# EAGLE board PCB_GW_ESP32_DIO_RS485 (EAGLE 7.7.0)
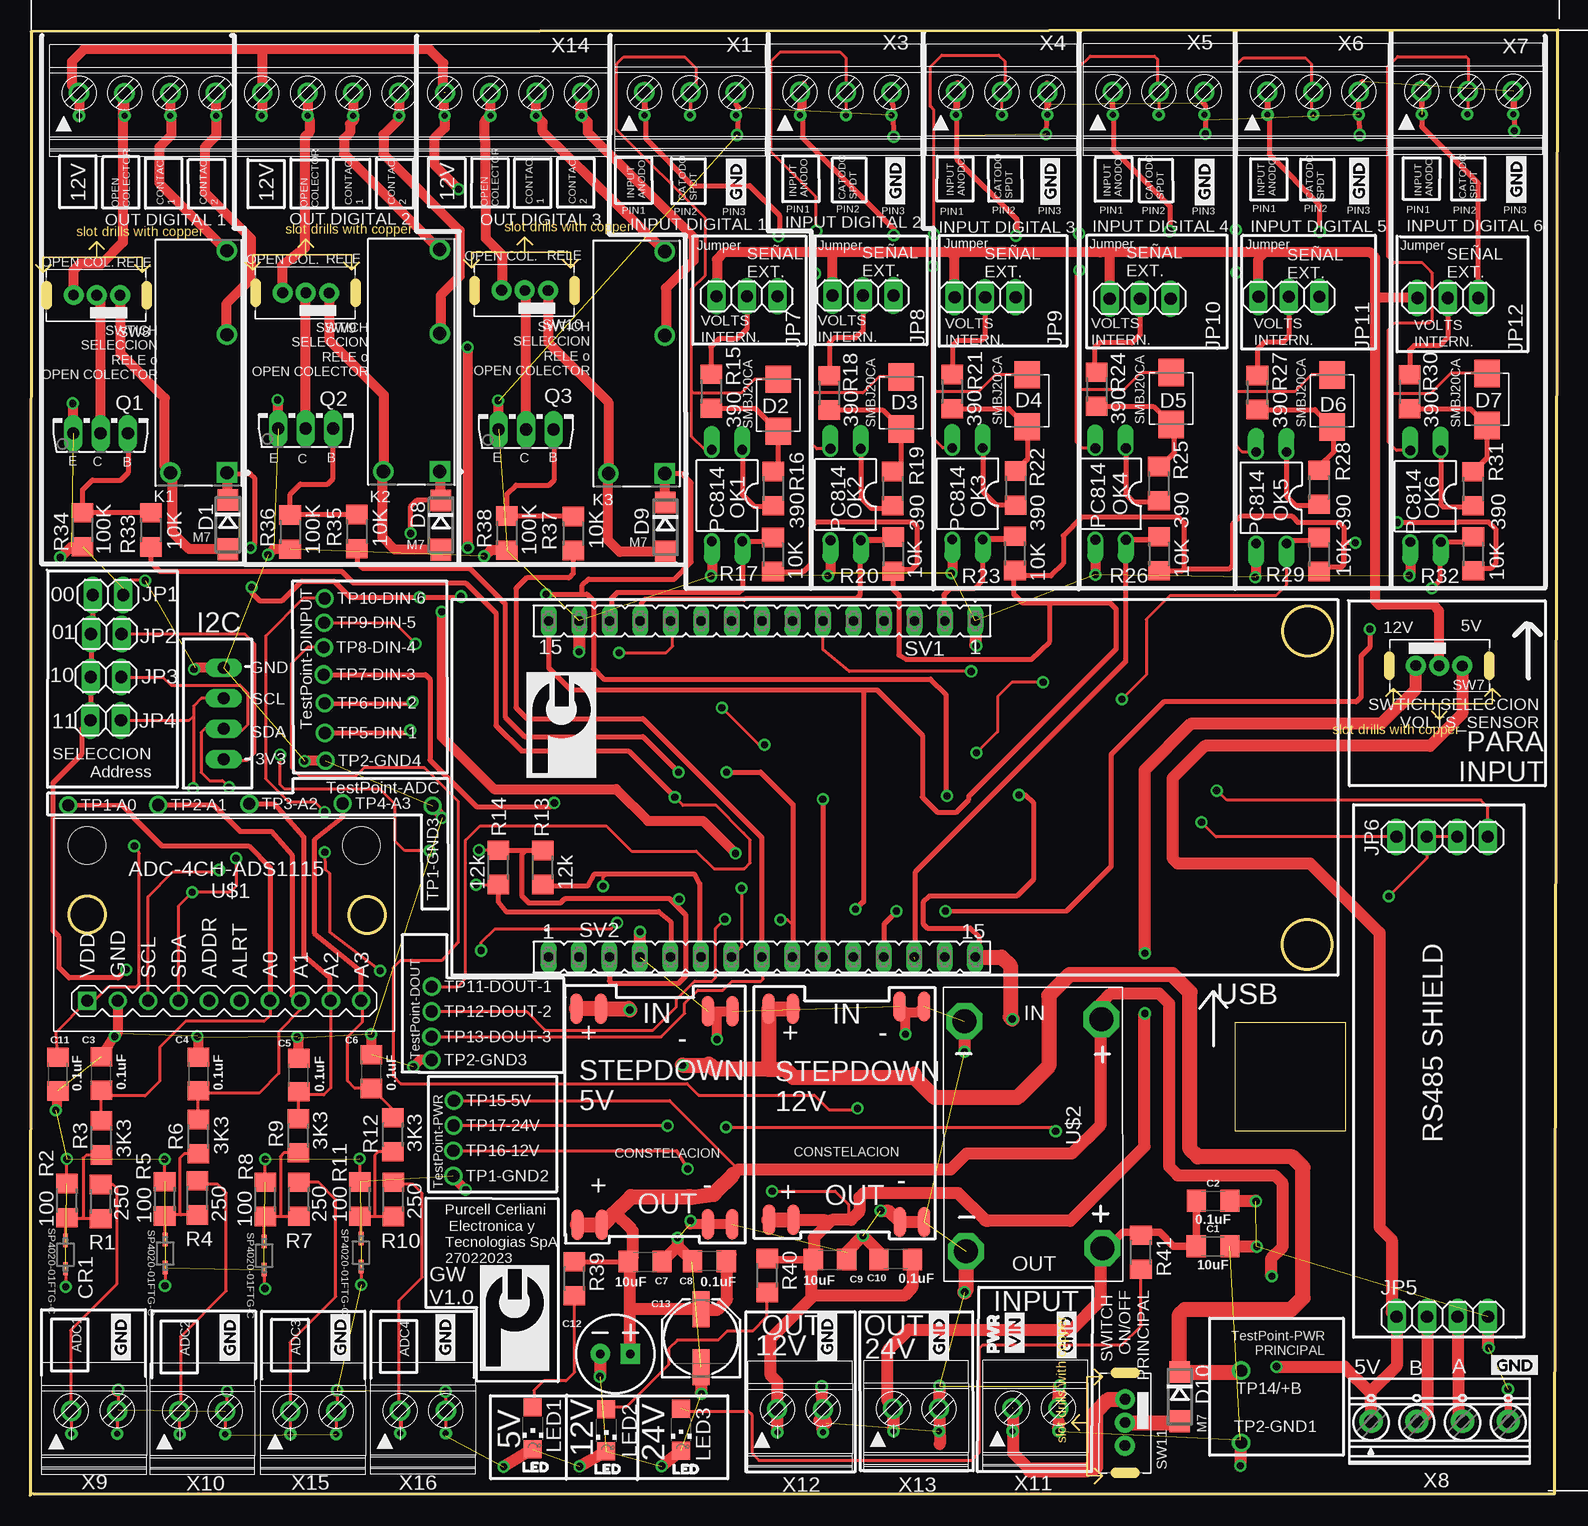
[diagram p2: board, top side]
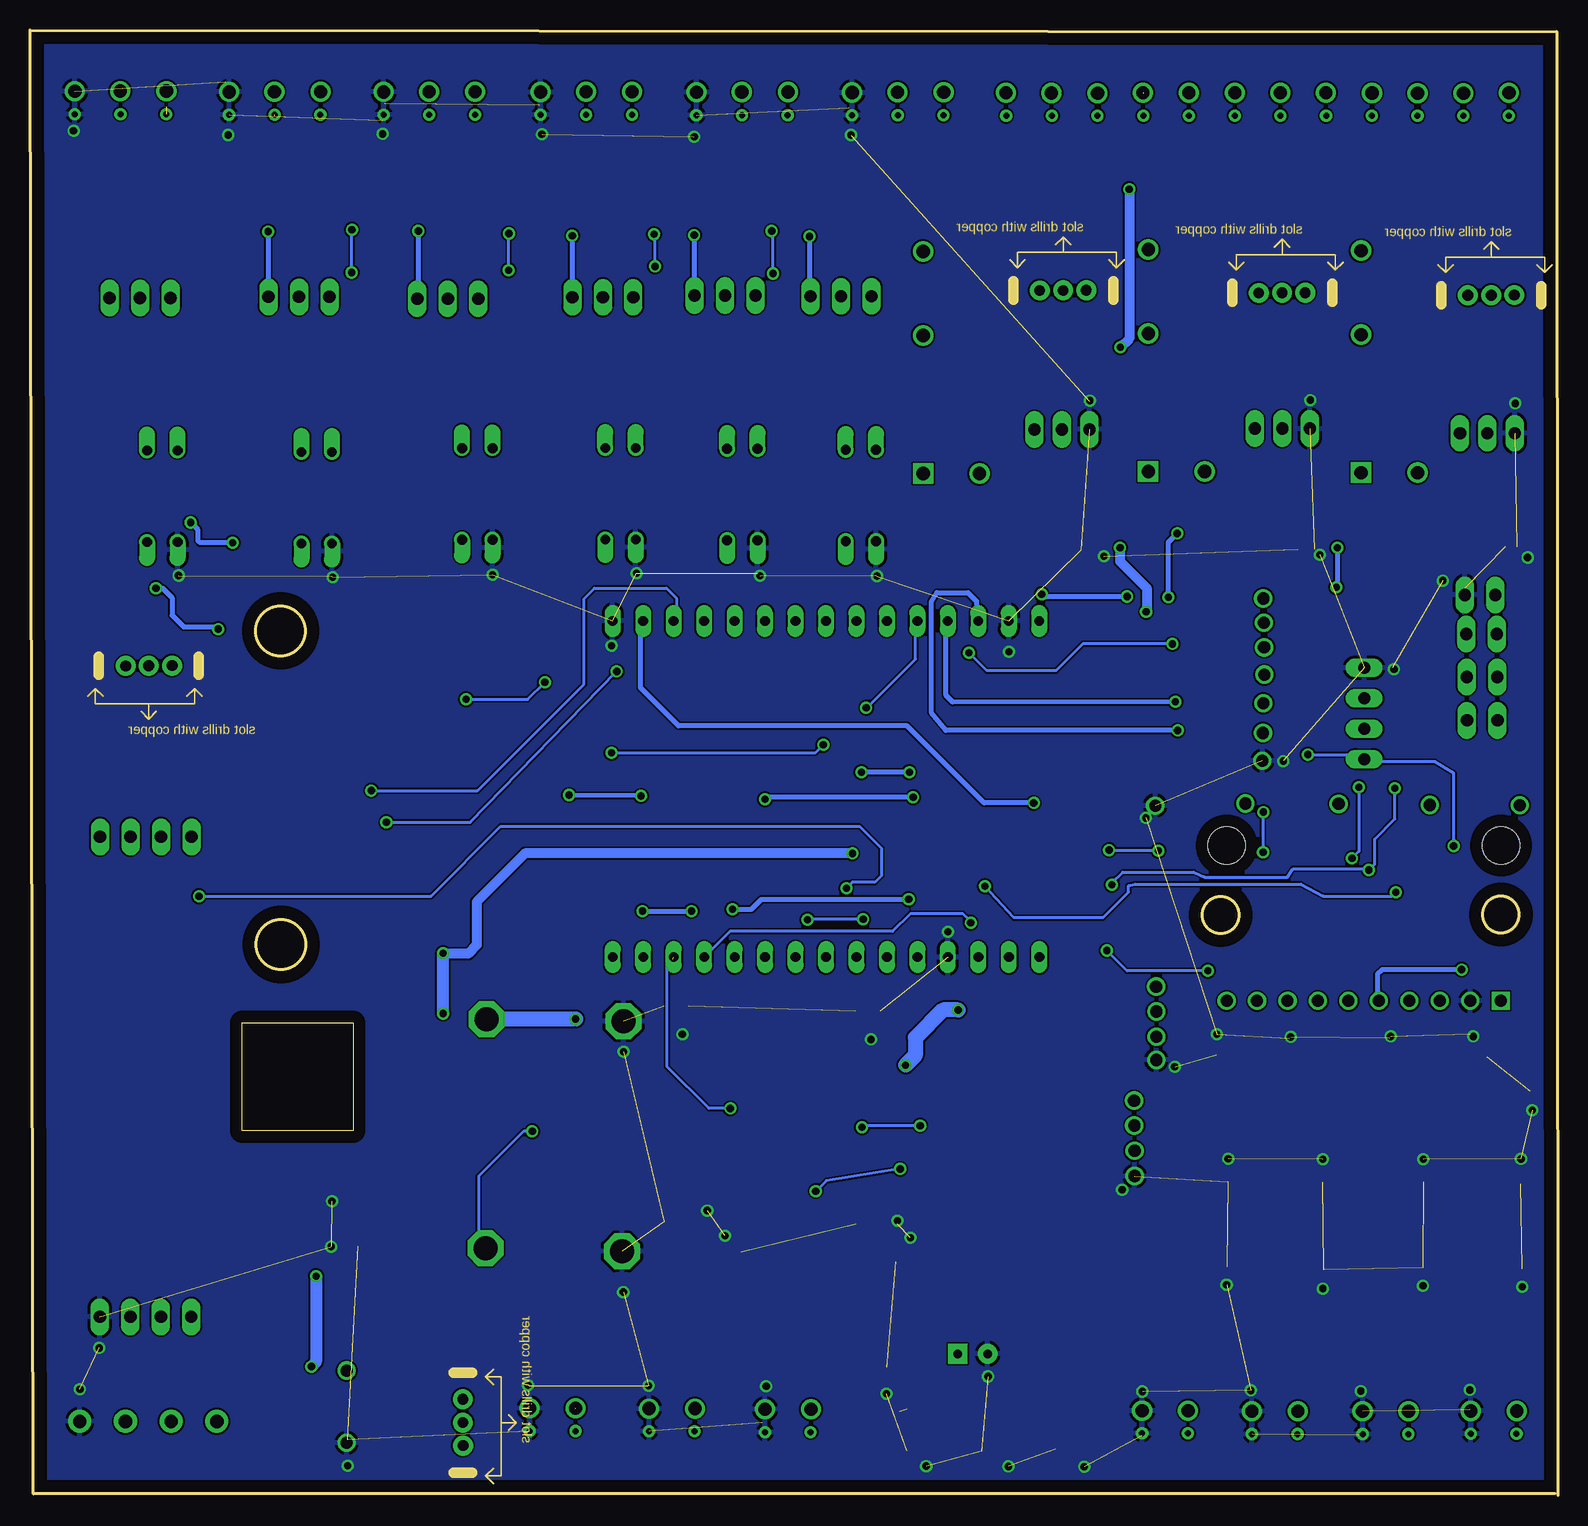
[diagram p3: board, bottom side, seen from below]

Size 127.37 x 122.13 mm. Coordinates in mm from the lower left corner, seen from the top.
Outline: 0.25,0.16 127.09,0.14 127.37,122.13 0.1,121.99 0,0
Outline: circle at 106.45,45.92 radius 2.07
Outline: circle at 106.49,72.05 radius 2.07
Outline: circle at 28.12,48.38 radius 1.5
Outline: circle at 4.76,48.42 radius 1.5
Copper layers (1*16): Top 0.035mm / dielectric 1.5mm / Bottom 0.035mm
Design rules "default": minimum track width 6mil, minimum drill 0.35mm, track to track 6mil, track to pad 6mil, pad to pad 6mil, via to via 6mil, smd to smd 6mil, copper to edge 40mil, drill to drill 6mil, minimum pad ring 10mil, minimum via ring 8mil, stop-mask expansion 4mil, vias tented up to drill 0mil, thermal gap 10mil

## Footprints (pad centres in the part's own frame; a part is rotated, then mirrored left to right if it is on the bottom)
1206 = smd 1.6 x 1.8: 1 -1.4,0; 2 1.4,0
CPOL-RADIAL-2.5MM-6.5MM = drill 0.7 pad 1.651 square: 1 1.25,0 | drill 0.7 pad 1.651: 2 -1.25,0
PANASONIC_D = smd 3 x 1.4: + 2.4,0; - -2.4,0
SOD323_LTF = smd 1.118 x 0.406: 1 -1.168,0; 2 1.168,0
DO214AC = smd 1.8 x 1.7: A 2.05,0; C -2.05,0
DIOM4336X265N = smd 2.28 x 2.12: 1 -2.165,0; 2 2.165,0
JST-XH-04-PACKAGE-LONG-PAD = drill 1.016 long: 1 -3.81,0; 2 -1.27,0; 3 1.27,0; 4 3.81,0
SOLDER_PAD_2 = smd 1.016 x 2.54: P$1 -1.016,0; P$2 1.016,0
1X02 = drill 1.016 long: 1 -1.27,0; 2 1.27,0
1X04 = drill 1.016 long: 1 -3.81,0; 2 -1.27,0; 3 1.27,0; 4 3.81,0
1X03 = drill 1.016 long: 1 -2.54,0; 2 0,0; 3 2.54,0
OMRON_G5NB-1A-E-DC5_0 = drill 1.1 pad 1.7 square: 1 -9.15,-2.35 | drill 1.1 pad 1.7: 2 2.35,-2.35; 3 9.35,-2.35; 4 -9.15,2.35
CHIPLED_1206 = smd 1.5 x 1.5: A 0,-1.75; C 0,1.75
DIL04 = drill 0.813 offset: 1 -1.27,-3.81; 2 1.27,-3.81; 3 1.27,3.81; 4 -1.27,3.81
TO126AV = drill 1.016 long: B 2.286,-1.27; C 0,-1.27; E -2.286,-1.27
R1206 = smd 1.6 x 1.803: 1 -1.422,0; 2 1.422,0
FE15 = drill 0.813 long: 1 -17.78,0; 2 -15.24,0; 3 -12.7,0; 4 -10.16,0; 5 -7.62,0; 6 -5.08,0; 7 -2.54,0; 8 0,0; 9 2.54,0; 10 5.08,0; 11 7.62,0; 12 10.16,0; 13 12.7,0; 14 15.24,0; 15 17.78,0
SW5-2.0-8.8X4.4X4.7MM-90D = drill 0.889 pad 1.651: A 0.01,1.952; B -0.01,-1.922; COM 0,0
TESTPOINT = drill 1.016: 1 0,0
ADC-4CH-ADS1115 = drill 1 square: 1 -6.35,11.43 | drill 1: 2 -6.35,8.89; 3 -6.35,6.35; 4 -6.35,3.81; 5 -6.35,1.27; 6 -6.35,-1.27; 7 -6.35,-3.81; 8 -6.35,-6.35; 9 -6.35,-8.89; 10 -6.35,-11.43 | hole 3.1: 6.604,11.43; 6.604,-11.43
DC-DC-STEP-UP-SX1308 = drill 2 pad 2.8 octagon: IN+ -14.87,6.3; IN- -14.73,-5.09; OUT+ 4.18,6.41; OUT- 4.47,-4.98
1705605 = drill 0.5 pad 0.9: 1.1 -13.335,-1.25; 2.1 -9.525,-1.25; 3.1 -5.715,-1.25 | drill 1.1 pad 1.676: 1.2 -13.355,0.67; 2.2 -9.505,0.67; 3.2 -5.725,0.65
1727036 = drill 1.1 pad 1.93: 1 -5.715,0; 2 -1.905,0; 3 1.905,0; 4 5.715,0
1705566 = drill 0.5 pad 0.9: 1.1 -5.715,-1.25; 2.1 -1.905,-1.25 | drill 1.1 pad 1.676: 1.2 -5.735,0.65; 2.2 -1.905,0.65
1705647 = drill 0.5 pad 0.9: 1.1 -20.955,-1.25; 2.1 -17.145,-1.25; 3.1 -13.335,-1.25; 4.1 -9.525,-1.25; 5.1 -5.715,-1.25; 6.1 -1.905,-1.25; 7.1 1.905,-1.25; 8.1 5.715,-1.25; 9.1 9.525,-1.25; 10.1 13.335,-1.25; 11.1 17.145,-1.25; 12.1 20.955,-1.25 | drill 1.1 pad 1.676: 1.2 -20.955,0.66; 2.2 -17.165,0.64; 3.2 -13.335,0.63; 4.2 -9.545,0.65; 5.2 -5.695,0.66; 6.2 -1.905,0.68; 7.2 1.885,0.68; 8.2 5.715,0.66; 9.2 9.555,0.67; 10.2 13.335,0.63; 11.2 17.175,0.65; 12.2 20.975,0.68

## Placement (x,y rotation side)
C1  10uF  [1206]  98.61,20.78 0 top
C2  0.1uF  [1206]  98.62,24.57 0 top
C3  0.1uF  [1206]  5.95,35.17 90 top
C4  0.1uF  [1206]  14.05,35.13 90 top
C5  0.1uF  [1206]  22.41,35.04 90 top
C6  0.1uF  [1206]  28.47,35.33 90 top
C7  10uF  [1206]  51.28,19.49 0 top
C8  0.1uF  [1206]  56.64,19.53 180 top
C9  10uF  [1206]  66.69,19.66 0 top
C10  0.1uF  [1206]  72.16,19.68 180 top
C11  0.1uF  [1206]  2.33,35.12 90 top
C12  100uF  [CPOL-RADIAL-2.5MM-6.5MM]  48.79,11.81 0 top
C13  100uF  [PANASONIC_D]  55.93,13.11 90 top
CR1  SP4020-01FTG-C  [SOD323_LTF]  2.96,20.07 90 top
CR2  SP4020-01FTG-C  [SOD323_LTF]  11.27,20.17 90 top
CR3  SP4020-01FTG-C  [SOD323_LTF]  19.52,19.99 90 top
CR4  SP4020-01FTG-C  [SOD323_LTF]  27.6,20.25 90 top
D1  [DO214AC]  16.49,80.91 270 top
D2  SMBJ20CA  [DIOM4336X265N]  62.36,90.86 270 top
D3  SMBJ20CA  [DIOM4336X265N]  72.62,91.06 270 top
D4  SMBJ20CA  [DIOM4336X265N]  83.13,91.23 270 top
D5  SMBJ20CA  [DIOM4336X265N]  95.14,91.42 270 top
D6  SMBJ20CA  [DIOM4336X265N]  108.55,91.22 270 top
D7  SMBJ20CA  [DIOM4336X265N]  121.44,91.35 270 top
D8  [DO214AC]  34.24,80.87 270 top
D9  [DO214AC]  52.95,80.7 270 top
D10  [DO214AC]  95.83,8.24 270 top
I2C  JST-XH-04-PIN-LONG-PAD  [JST-XH-04-PACKAGE-LONG-PAD]  16.15,65.17 90 top
J1  SOLDER_PAD_2  [SOLDER_PAD_2]  46.57,40.57 0 top
J2  SOLDER_PAD_2  [SOLDER_PAD_2]  57.53,40.35 0 top
J3  SOLDER_PAD_2  [SOLDER_PAD_2]  46.65,22.57 0 top
J4  SOLDER_PAD_2  [SOLDER_PAD_2]  57.52,22.6 0 top
J5  SOLDER_PAD_2  [SOLDER_PAD_2]  62.58,40.56 180 top
J6  SOLDER_PAD_2  [SOLDER_PAD_2]  73.52,22.8 180 top
J7  SOLDER_PAD_2  [SOLDER_PAD_2]  62.62,22.98 0 top
J8  SOLDER_PAD_2  [SOLDER_PAD_2]  73.51,40.76 0 top
JP1  00  [1X02]  6.49,75.05 0 top
JP2  01  [1X02]  6.36,71.8 0 top
JP3  10  [1X02]  6.33,68.21 0 top
JP4  11  [1X02]  6.31,64.6 0 top
JP5  [1X04]  117.73,14.89 0 top
JP6  [1X04]  117.72,54.89 0 top
JP7  [1X03]  59.76,99.94 180 top
JP8  [1X03]  69.44,100.01 180 top
JP9  [1X03]  79.62,99.86 180 top
JP10  [1X03]  92.54,99.73 180 top
JP11  [1X03]  104.95,99.89 180 top
JP12  [1X03]  118.2,99.8 180 top
K1  OMRON_G5NB-1A-E-DC5OMRON_G5NB-1A-E-DC5_0_0  [OMRON_G5NB-1A-E-DC5_0]  14.06,94.39 90 top
K2  OMRON_G5NB-1A-E-DC5OMRON_G5NB-1A-E-DC5_0_0  [OMRON_G5NB-1A-E-DC5_0]  31.8,94.48 90 top
K3  OMRON_G5NB-1A-E-DC5OMRON_G5NB-1A-E-DC5_0_0  [OMRON_G5NB-1A-E-DC5_0]  50.57,94.32 90 top
LED1  [CHIPLED_1206]  41.91,5.59 180 top
LED2  [CHIPLED_1206]  48.04,5.43 180 top
LED3  [CHIPLED_1206]  54.28,5.5 180 top
OK1  PC814  [DIL04]  58.11,83.34 180 top
OK2  PC814  [DIL04]  67.99,83.42 180 top
OK3  PC814  [DIL04]  78.15,83.49 180 top
OK4  PC814  [DIL04]  90.08,83.47 180 top
OK5  PC814  [DIL04]  103.47,83.15 180 top
OK6  PC814  [DIL04]  116.33,83.28 180 top
Q1  2SD882  [TO126AV]  5.88,89.79 0 top
Q2  2SD882  [TO126AV]  22.98,90.19 0 top
Q3  2SD882  [TO126AV]  41.35,90.11 0 top
R1  250  [R1206]  5.9,24.5 270 top
R2  100  [R1206]  3.08,24.58 270 top
R3  3K3  [R1206]  5.95,29.8 270 top
R4  250  [R1206]  13.97,24.81 270 top
R5  100  [R1206]  11.23,24.72 270 top
R6  3K3  [R1206]  14.04,29.91 270 top
R7  250  [R1206]  22.43,24.69 270 top
R8  100  [R1206]  19.61,24.68 270 top
R9  3K3  [R1206]  22.39,29.99 270 top
R10  250  [R1206]  30.29,24.68 270 top
R11  100  [R1206]  27.51,24.71 270 top
R12  3K3  [R1206]  30.26,30.07 270 top
R13  12k  [R1206]  42.74,52.34 270 top
R14  12k  [R1206]  39.04,52.35 270 top
R15  390  [R1206]  56.79,92.03 90 top
R16  390  [R1206]  61.97,83.91 90 top
R17  10K  [R1206]  61.94,78.42 90 top
R18  390  [R1206]  66.62,91.89 90 top
R19  390  [R1206]  71.92,83.91 90 top
R20  10K  [R1206]  71.95,78.45 90 top
R21  390  [R1206]  76.86,92 90 top
R22  390  [R1206]  82.17,83.96 90 top
R23  10K  [R1206]  82.1,78.51 90 top
R24  390  [R1206]  88.92,92.19 90 top
R25  390  [R1206]  94.1,84.33 90 top
R26  10K  [R1206]  94.11,78.49 90 top
R27  390  [R1206]  102.31,91.92 90 top
R28  390  [R1206]  107.45,84.02 90 top
R29  10K  [R1206]  107.47,78.42 90 top
R30  390  [R1206]  114.99,91.98 90 top
R31  390  [R1206]  120.3,83.9 90 top
R32  10K  [R1206]  120.31,78.48 90 top
R33  10K  [R1206]  10.07,80.47 90 top
R34  100K  [R1206]  4.39,80.48 90 top
R35  10K  [R1206]  27.25,80.33 90 top
R36  100K  [R1206]  21.69,80.29 90 top
R37  10K  [R1206]  45.28,80.17 90 top
R38  100K  [R1206]  39.76,80.21 90 top
R39  390  [R1206]  45.38,18.07 270 top
R40  1k  [R1206]  61.45,18.34 270 top
R41  3k3  [R1206]  92.6,20.27 270 top
SV1  [FE15]  61.02,72.89 180 top
SV2  [FE15]  61.01,44.87 0 top
SW7  SWTICH_SELECCION_VOLTS_SENSOR  [SW5-2.0-8.8X4.4X4.7MM-90D]  117.47,69.15 90 top
SW8  SWTICH_SELECCION_RELE/OPENCOLECTOR  [SW5-2.0-8.8X4.4X4.7MM-90D]  5.56,100.03 270 top
SW9  SWTICH_SELECCION_RELE/OPENCOLECTOR  [SW5-2.0-8.8X4.4X4.7MM-90D]  22.99,100.23 270 top
SW10  SWTICH_SELECCION_RELE/OPENCOLECTOR  [SW5-2.0-8.8X4.4X4.7MM-90D]  41.24,100.43 270 top
SW11  [SW5-2.0-8.8X4.4X4.7MM-90D]  91.28,6.08 0 top
TP1-A0  TESTPOINT  [TESTPOINT]  3.19,57.53 0 top
TP1-GND2  TESTPOINT  [TESTPOINT]  35.29,26.63 0 top
TP1-GND3  TESTPOINT  [TESTPOINT]  33.57,57.49 270 top
TP2-A1  TESTPOINT  [TESTPOINT]  10.69,57.55 0 top
TP2-GND1  TESTPOINT  [TESTPOINT]  100.97,4.4 0 top
TP2-GND3  TESTPOINT  [TESTPOINT]  33.48,36.3 0 top
TP2-GND4  TESTPOINT  [TESTPOINT]  24.64,61.23 0 top
TP3-A2  TESTPOINT  [TESTPOINT]  18.28,57.64 0 top
TP4-A3  TESTPOINT  [TESTPOINT]  26.06,57.67 0 top
TP5-DIN-1  TESTPOINT  [TESTPOINT]  24.59,63.55 0 top
TP6-DIN-2  TESTPOINT  [TESTPOINT]  24.56,66.03 0 top
TP7-DIN-3  TESTPOINT  [TESTPOINT]  24.48,68.41 0 top
TP8-DIN-4  TESTPOINT  [TESTPOINT]  24.49,70.68 0 top
TP9-DIN-5  TESTPOINT  [TESTPOINT]  24.52,72.74 0 top
TP10-DIN-6  TESTPOINT  [TESTPOINT]  24.57,74.76 0 top
TP11-DOUT-1  TESTPOINT  [TESTPOINT]  33.49,42.41 0 top
TP12-DOUT-2  TESTPOINT  [TESTPOINT]  33.48,40.34 0 top
TP13-DOUT-3  TESTPOINT  [TESTPOINT]  33.47,38.23 0 top
TP14/+B  TESTPOINT  [TESTPOINT]  100.97,10.41 0 top
TP15-5V  TESTPOINT  [TESTPOINT]  35.33,32.91 0 top
TP16-12V  TESTPOINT  [TESTPOINT]  35.29,28.74 0 top
TP17-24V  TESTPOINT  [TESTPOINT]  35.32,30.84 0 top
U$1  ADC-4CH-ADS1115  [ADC-4CH-ADS1115]  16.19,47.57 90 top
U$2  DC-DC-STEP-UP-SX1308  [DC-DC-STEP-UP-SX1308]  83,24.81 270 top
U$3  [VIN_P]  82.07,11.38 90 top
U$4  [PWR_TO]  80.29,10.93 90 top
U$5  [LED_TO]  40.3,2.38 0 top
U$6  [LED_TO]  46.3,2.22 0 top
U$7  [LED_TO]  52.81,2.21 0 top
U$8  [GND_P]  86.42,10.97 90 top
U$9  [GND_P]  75.77,10.82 90 top
U$10  [GND_P]  66.45,10.81 90 top
U$11  [GND_P]  7.57,10.78 90 top
U$12  [GND_P]  16.64,10.74 90 top
U$13  [GND_P]  25.87,10.76 90 top
U$14  [GND_P]  34.62,10.77 90 top
U$15  [GND_P]  121.33,10.87 0 top
U$16  [GND_P]  58.85,107.05 90 top
U$17  [GND_P]  72.13,107.15 90 top
U$18  [GND_P]  85.05,107.1 90 top
U$19  [GND_P]  97.91,107.06 90 top
U$20  [GND_P]  110.78,107.13 90 top
U$21  [GND_P]  123.89,107.27 90 top
X1  1705605  [1705605]  64.56,116.27 0 top
X3  1705605  [1705605]  77.54,116.29 0 top
X4  1705605  [1705605]  90.53,116.31 0 top
X5  1705605  [1705605]  103.61,116.32 0 top
X6  1705605  [1705605]  116.5,116.32 0 top
X7  1705605  [1705605]  129.35,116.37 0 top
X8  1727036  [1727036]  117.51,6.18 0 top
X9  1705566  [1705566]  9.17,6.4 0 top
X10  1705566  [1705566]  18.19,6.38 0 top
X11  1705566  [1705566]  87.62,6.63 0 top
X12  1705566  [1705566]  68.01,6.54 0 top
X13  1705566  [1705566]  77.68,6.6 0 top
X14  1705647  [1705647]  25.04,116.23 0 top
X15  1705566  [1705566]  27.42,6.38 0 top
X16  1705566  [1705566]  36.57,6.43 0 top

## Tracks (layer width: path | path; a pad name or v marks a point on that pad's centre or on a via)
3.3V  (via drill 0.6)
  Top 0.254: JP2.2 17.91,71.8 18.73,70.98 18.73,61.88 18.09,61.24 16.27,61.24 I2C.1 | C11.2 2.17,38.63 U$1.1 5.36,41.22 6.53,42.39 8.85,42.39 9.11,42.65 9.11,53.51 v8.7,54.13 | R14.1 37.44,53.77 v37.42,53.79 | v33.3,53.74 31.23,53.74 30.43,54.54 30.43,57.62 29.18,58.87 21.22,58.87 20.87,59.22 20.87,61.72 v20.84,61.75
  Top 0.406: R14.1 41.33,53.77 | 41.33,53.77 42.73,53.77 R13.1 42.78,53.8 | SV2.3 48.31,42.86 48.49,42.68 54.05,42.68 54.68,43.31 54.68,48.38 53.54,49.52 | SV1.15 43.24,68.97 45.07,67.14 69.4,67.14 | 69.4,67.14 70.61,67.14 74.38,63.37 74.38,58.21 75.63,56.96 77.23,56.96 78.27,58 78.27,58.26 90.56,70.55 90.56,73.88 90.08,74.36 84.98,74.36 | 84.98,74.36 82.77,74.36 82,75.13 82,76.99 R23.1 82.55,76.64 85.11,76.64 86.13,77.66 86.13,79.99 87.66,81.52 95.76,81.52 96.24,81.04 96.24,77.25 | 84.98,74.36 85,74.34 85,71.17 83.47,69.69 73.05,69.69 72.43,70.04 72.43,75.03 71.95,75.51 R20.1 72.09,77.17 73.48,77.17 73.93,77.62 73.93,80.77 73.56,81.14 65.57,81.14 65.09,80.66 65.09,77.61 64.48,77 R17.1 | R26.1 96.06,77.07 96.24,77.25 | 96.24,77.25 100.01,77.25 100.29,77.53 100.29,81.01 100.93,81.65 105.17,81.65 105.46,81.36 105.46,81.32 105.68,81.1 109.13,81.1 109.54,80.69 109.54,79.44 | 109.54,79.44 109.54,77.63 109.25,77.34 | 109.25,77.34 107.97,77.34 | 107.97,77.34 107.81,77.34 R29.1 107.63,77 107.97,77.34 | 109.25,77.34 109.3,77.34 109.51,77.55 109.51,79.41 109.54,79.44 | 109.54,79.44 110.44,79.44 v110.47,79.41 | v113.98,81.09 119.04,81.09 119.1,81.15 121.58,81.15 122.18,80.55 122.18,77.67 121.75,77.24 120.49,77.24 R32.1 | 53.54,49.52 53.31,49.75 44.62,49.75 44.53,49.66 44.48,49.66 44.2,49.38 41.6,49.38 41.04,49.94 41.04,53.48 41.33,53.77 | v68.81,48.85 69.44,49.48 69.48,49.48 69.48,67.06 69.4,67.14 | v54.12,49.7 53.72,49.7 53.54,49.52
  Bottom 0.254: v8.7,54.13 8.7,60.2 10.27,61.17 15.96,61.17 I2C.1 16.54,61.75 v20.84,61.75 | v37.42,53.79 33.35,53.79 v33.3,53.74
  Bottom 0.406: v110.47,79.41 113.22,79.41 113.36,79.55 113.36,80.47 v113.98,81.09 | v68.81,48.85 67.24,48.85 66.4,49.69 v54.13,49.69 v54.12,49.7
5V  (via drill 0.6)
  Top 0.254: TP15-5V.1 53.32,32.91 59.04,27.19
  Top 0.406: 16.49,85.16 18.36,85.16 18.71,84.81 18.71,79.31 v18.39,78.99 | v18.47,75.7 18.47,75.24 19.14,74.57 21.02,74.57 22.66,76.21 25.34,76.21 26.69,74.86 v32.47,74.86 v32.48,74.87 35.87,74.87 v35.92,74.92 | v31.74,80.18 31.74,82.43 32.28,82.97 34.19,82.97 D8.C | v43.03,75.11 45.88,75.11 | 45.88,75.11 46.42,75.11 46.96,74.57 46.96,68.89 47.81,68.04 75.07,68.04 76.35,66.76 76.35,58.39 v76.44,58.3 | K3.1 54.36,85.16 55.12,84.4 55.12,77.79 53.71,76.38 46.57,76.38 45.99,75.8 45.99,75.22 45.88,75.11 | v82.44,58.38 83.02,58.38 83.63,57.77 83.63,51.31 82.27,49.95 74.97,49.95 74.45,49.43 74.45,47.66 74.82,47.29 78.39,47.29 79.09,46.59 79.09,44.48 79,44.39 79,44.66 SV2.15 | R39.1 C7.1
  Top 0.61: 58.6,20.09 C8.1 | 50.26,19.87 C7.1
  Top 0.813: D1.C 16.49,85.16 K1.1 | D8.C 34.24,85.24 K2.1 | D9.C 52.95,85.14 K3.1
  Top 1.016: 58.6,26.75 59.04,27.19 76.77,27.19 78.09,28.51 86.84,28.51 89.25,30.92 89.25,39.63 U$2.IN+ 89.3,41.03 90.12,41.85 94.11,41.85 94.94,41.02 94.94,27.43 95.68,26.69 103.77,26.69 104.38,26.08 104.38,20.66 103.45,19.73 103.45,18.35 v103.52,18.28 | C12.1 50.04,15.68 | 50.04,15.68 50.04,19.33 C7.1 | C8.1 58.1,19.47 58.1,16.44 arc-45 58.01,16.22 57.25,15.46 56.05,15.46 arc-45 C13.+ 50.34,15.51 arc-45 50.12,15.6 50.04,15.68 | SW7.B 119.39,65.14 116.72,62.47 97.94,62.47 95.23,59.76 95.23,53.12 95.66,52.69 106.7,52.69 112.48,46.91 112.48,22.36 113.51,21.33 113.51,15.3 JP5.1 113.92,10.78 111.73,8.59 | 111.73,8.59 111.79,6.3 X8.1 | v103.91,10.75 109.57,10.75 111.73,8.59 | 50.26,19.87 50.26,21.91 arc45 50.17,22.13 48.74,23.57
  Top 1.27: SV2.15 81.02,44.87 81.71,44.18 81.71,39.88 v81.88,39.71 | J3.P$1 J3.P$2 arc45 47.79,22.62 48.74,23.57 50.09,24.92 54.88,24.92 arc-45 55.1,24.83 55.38,24.89 57,25.1 arc45 57.12,25.29 58.6,26.75
  Bottom 0.406: v18.39,78.99 18.39,75.78 v18.47,75.7 | v32.48,74.87 32.48,79.44 v31.74,80.18 | v35.92,74.92 42.84,74.92 v43.03,75.11 | v76.44,58.3 82.4,58.34 v82.44,58.38
  Bottom 1.016: v103.52,18.28 103.52,11.14 v103.91,10.75
  Bottom 1.27: v81.88,39.71 89.27,39.71 U$2.IN+
12V  (via drill 0.6)  (1 unrouted)
  Top 0.254: TP16-12V.1 53.91,28.74 v54.83,27.22 | v61.87,25.37 67.11,25.37 68.21,24.27 68.21,23.21 68.44,22.98
  Top 0.61: C10.1 73.56,20.03 | C9.1 61.55,19.66 R40.1
  Top 0.813: 19.06,120.53 33.29,120.53 34.45,119.37 34.45,116.98 34.52,116.91 34.52,115.67 | 19.06,120.53 4.51,120.53 3.48,119.5 3.48,117.5 X14.1.2 X14.1.1 3.98,114.87 | 19.06,120.53 19.34,120.27 X14.5.1 | v35.74,108.86 33.69,110.91 33.69,113.09 34.56,113.97 X14.9.1 | v36.47,95.69 36.47,79.02 v36.5,78.99 | v34.33,73.66 34.33,63.22 38.69,58.86 48.87,58.86 51.5,56.23 56.1,56.23 v58.82,53.51
  Top 1.016: 65.16,16.78 65.16,16.5 61.73,13.07 61.73,10.02 62.3,9.45 X12.1.1 62.28,5.31 X12.1.2 | 65.16,16.78 65.16,19.53 C9.1 65.34,19.71 65.34,21.47 66.53,22.66 | 66.53,22.66 66.85,22.98 68.44,22.98 69.05,23.59 arc45 69.14,23.81 69.14,24.83 69.43,25.12 arc-45 69.65,25.21 77.37,25.21 79.6,22.98 arc45 79.83,22.89 86.72,22.89 92.9,29.07 92.9,40.14 v92.93,40.17 | v92.93,45.2 92.93,60.46 96.82,64.35 112.66,64.35 115.5,67.19 115.5,69.14 SW7.A | J7.P$2 66.08,22.98 arc-45 66.3,22.89 66.53,22.66 | 73.56,20.03 73.56,17.48 arc-45 73.47,17.26 72.88,16.67 65.4,16.67 arc-45 65.18,16.76 65.16,16.78
  Top 1.27: J7.P$1 J7.P$2
  Bottom 0.254: v54.83,27.22 60.99,26.25 v61.87,25.37
  Bottom 0.813: v35.74,108.86 35.74,96.42 v36.47,95.69 | v36.5,78.99 36.5,77.84 34.27,75.61 34.27,73.72 v34.33,73.66 | v58.82,53.51 86.1,53.51 90.13,49.48 90.13,45.86 90.82,45.17 92.9,45.17 v92.93,45.2
  Bottom 1.016: v92.93,40.17 v92.93,45.2
24V  (via drill 0.6)
  Top 0.254: TP17-24V.1 v53.15,30.84 v53.16,30.83 | v58.01,30.7 85.16,30.7 v85.5,30.36
  Top 0.61: C1.1 96.62,20.78 | 96.62,20.78 95.33,20.78 94.17,21.94 92.85,21.94 R41.1 92.35,21.94 91.09,21.94 89.78,20.63 U$2.OUT+ | C2.1 97.22,21.38 96.62,20.78
  Top 1.016: U$2.OUT+ 89.29,20.51 89.29,16.26 86.86,13.83 73.23,13.83 71.49,12.09 71.49,7.88 72,7.37 72,5.45 71.95,5.5 X13.1.2
  Bottom 0.254: v53.16,30.83 57.88,30.83 v58.01,30.7 | v85.5,30.36 86.22,30.36 89.97,26.61 89.97,21.19 U$2.OUT+
+B  (via drill 0.6)
  Top 1.27: TP14/+B.1 100.85,10.29 D10.C 95.83,15.09 96.26,15.52 105.16,15.52 106.11,16.47 106.11,27.34 105.23,28.22 97.35,28.22 96.7,28.87 96.7,41.95 95.23,43.42 86.65,43.42 84.92,41.69 84.92,35.78 82.31,33.17 75.42,33.17 73.69,34.9 73.69,35.15 73.39,34.85 63.64,34.85 62.96,35.53 61.55,35.53 | 61.55,35.53 61.41,35.53 61.38,35.56 57.01,35.56 56.6,35.97 56.51,35.87 v54.38,35.87 | J5.P$1 J5.P$2 61.56,35.54 61.55,35.53 | J1.P$1 J1.P$2 49.9,40.57 v50,40.47
  Bottom 1.27: v50,40.47 51.26,40.47 53.56,38.17 53.56,36.69 v54.38,35.87
A
  Top 1.016: JP5.3 119.07,6.06 X8.3
A0
  Top 0.254: R3.1 C3.1 6.41,33.31 9.6,33.31 10.83,34.54 10.83,37.37 12.97,39.51 19.51,39.51 20,40 U$1.7
  Top 0.406: TP1-A0.1 7.66,57.55 8.53,56.68 8.53,56.61 10.99,54.15 18.21,54.15 20.04,52.32 20.04,41.26 U$1.7
A1
  Top 0.254: R6.1 C4.1 14.24,33.54 19.09,33.54 20.74,35.19 20.74,38.67 22.54,40.47 U$1.8
  Top 0.406: TP2-A1.1 15.29,57.55 17.5,55.34 20.12,55.34 21.85,53.37 21.85,41.67 U$1.8
A2
  Top 0.254: R9.1 22.39,33.62 C5.1 22.66,33.39 24.49,33.39 25.08,33.98 U$1.9
  Top 0.406: TP3-A2.1 20.36,57.64 22.82,54.86 22.82,45.01 24.96,43.19 24.96,41.34 U$1.9
A3
  Top 0.254: R12.1 30.26,32.14 C6.1 27.08,33.93 26.46,34.55 26.46,38.22 27.71,39.47 27.71,41.13 U$1.10
  Top 0.406: TP4-A3.1 26.08,56.53 23.69,54.65 23.69,46.87 27.58,43.75 27.58,41.26 U$1.10
ADC_1
  Top 0.254: R1.1 5.91,25.91 6.92,25.91 7.26,25.57 7.26,17.65 3.39,13.78 3.39,7.1 X9.1.2 3.44,4.95 3.4,4.91
ADC_2
  Top 0.254: R4.1 14.25,25.95 15.64,25.95 16.36,25.23 16.36,17.05 12.56,13.24 12.56,7.13 X10.1.2 12.46,5.16 12.51,5.1
ADC_3
  Top 0.254: R7.1 24.05,26.11 25.49,24.67 25.49,16.57 21.69,12.76 X15.1.2 21.69,5.16 X15.1.1
ADC_4
  Top 0.254: R10.1 30.43,25.96 31.92,25.96 32.7,25.18 32.7,18.21 30.76,16.27 30.76,7.32 30.96,7.12 30.96,5.18 30.84,5.3 X16.1.2
B
  Top 1.016: JP5.2 116.46,6.81 115.37,5.72 115.79,6.21 X8.2
ENERGIA_SENSOR_EXTERNO
  Top 0.813: SW7.COM 117.47,73.71 116.96,74.22 112.45,74.22 112.14,74.53 112.14,99.77 | 112.14,99.77 112.21,99.84 115.62,99.84 JP12.3 | 112.14,99.77 112.14,103.18 111.73,103.59 102.95,103.59 | 102.95,103.59 89.19,103.59 | 89.19,103.59 76.73,103.59 | 76.73,103.59 66.65,103.59 | 66.65,103.59 57.86,103.59 57.27,103 57.27,99.99 JP7.3 | JP8.3 66.9,103.34 66.65,103.59 | JP9.3 77.08,103.24 76.73,103.59 | JP10.3 90.01,103.6 89.19,103.59 | JP11.3 102.41,103.05 102.95,103.59
GND  (via drill 0.6)  (64 unrouted)
  Top 0.254: R2.1 v3.08,28.05 | R5.1 v11.23,28.02 v11.22,28.03 | R11.1 27.51,28.04 v27.49,28.06 | R8.1 v19.61,28.03 | CR1.1 v2.96,17.4 v2.97,17.39 | CR2.1 11.27,17.5 v11.25,17.48 | CR3.1 19.52,17.32 v19.59,17.25 | CR4.1 27.6,17.58 v27.62,17.56 | JP1.2 7.76,75.61 8.45,76.3 9.55,76.3 v9.6,76.25 | 7.22,5.12 7.27,5.17 X9.2.2 7.36,7.14 v7.36,8.8 | 16.59,5.01 16.28,5.31 X10.2.2 16.39,7.13 16.39,8.65 | 25.59,5.11 25.52,5.19 X15.2.2 25.61,7.12 v25.61,8.76 | 34.66,5 34.67,5 X16.2.2 34.63,7.12 v34.63,8.67
  Top 0.406: X1.3.2 58.84,115.91 59.09,115.66 59.09,115.64 59.01,115.56 59.01,114.77 v58.94,113.38 | X3.3.2 71.86,115.94 71.95,115.85 71.95,114.52 v72,113.24 | X4.3.1 84.81,115.78 84.93,115.9 84.93,117.54 84.74,117.73 84.74,114.7 v84.7,113.45 | X5.3.2 97.81,116.02 97.97,115.85 97.97,114.61 v97.98,113.47 | 111.07,117.83 110.78,117.55 X6.3.1 110.78,114.47 v110.84,113.38 | X7.3.1 123.69,117.61 123.74,117.25 v123.74,113.73
  Top 0.61: v123.21,8.85 123.21,6.2 X8.4
  Top 0.813: 34.62,8.65 v34.63,8.67 | 25.52,8.66 v25.61,8.76 | 7.22,8.65 v7.36,8.8 | 16.39,8.65 v16.44,8.71 | C11.1 2.17,32.14 v2.14,32.11 | C3.2 6.94,38.14 v7.06,38.26 7.3,38.5 U$1.2 | C4.2 14.05,38.16 v13.95,38.26 | C5.2 22.41,38.09 v22.28,38.22 | C6.2 28.47,38.4 v28.44,38.43 | TP2-GND3.1 32.52,36.3 v31.95,35.73 | TP1-GND2.1 35.29,26.52 v36.33,25.48 | I2C.4 13.79,68.98 v13.67,68.86 | TP2-GND4.1 22.9,61.23 v22.88,61.21 | R34.1 3.42,79.06 v2.53,78.17 | R36.1 20.3,78.87 v19.84,78.41 | R38.1 38.38,78.79 v37.86,78.27 | OK1.3 56.84,76.71 v56.76,76.63 | OK2.3 66.72,76.86 v66.52,76.66 | OK3.3 76.88,76.94 v76.81,76.87 | OK4.3 v88.81,76.75 v88.8,76.74 | OK5.3 102.2,76.6 v102.13,76.53 | OK6.3 115.06,76.74 v114.99,76.67 | Q1.E 3.59,90.99 v3.57,91.01 | Q2.E 20.69,91.25 v20.65,91.29 | Q3.E 39.06,91.2 v39.01,91.25 | TP1-GND3.1 33.63,57.5 v34.34,56.47 | J4.P$2 J4.P$1 55.05,22.6 v55.05,22.89 | J2.P$1 57.37,40.35 | 57.37,40.35 J2.P$2 | v57.27,38.01 57.27,40.25 57.37,40.35 | v72.99,38.44 72.99,40.26 | 72.99,40.26 J8.P$1 | 72.99,40.26 74.03,40.26 J8.P$2
  Top 1.016: C13.- 55.93,8.53 v55.98,8.48 | 55.2,19.49 C8.2 53.98,20.79 | v53.98,21.49 53.98,20.79 | C12.2 47.54,9.96 v47.5,9.92 | LED1.C v39.49,2.41 | LED2.C v45.81,2.44 v45.8,2.43 | LED3.C 52.71,2.51 v52.66,2.46 | C10.2 70.76,20.32 v69.44,21.64 68.09,20.29 C9.2 | C7.2 53.98,20.79 | X12.2.2 v66,9.1 | v75.8,9.14 75.84,9.11 X13.2.2 75.84,4.3 75.82,4.29 | X11.2.2 85.77,9.11 v85.85,9.19 | C2.2 102.15,24.57 v102.2,24.52 | C1.2 102.23,20.78 v102.26,20.75 | TP2-GND1.1 100.9,4.64 v100.89,2.48 | X11.2.1 85.77,6.19 85.76,6.19 | X12.2.1 66,6.38 66.05,6.43 66.21,6.43 66.25,6.39 66.25,6.17 66.36,6.06 66.01,6.06 65.81,6.26 | U$2.IN- v77.91,37 v77.9,36.99 | SV2.4 v50.85,46.97 v50.86,46.98 | SV1.14 45.78,70.34 v45.76,70.32 | SV1.1 78.8,70.9 v78.88,70.82 | JP5.4 121.54,12.36 v121.6,12.3 | J6.P$1 J6.P$2 71.65,23.66 arc45 71.42,23.75 v70.91,23.75
  Top 1.27: U$2.OUT- 78.02,17.07 v77.91,16.96
  pour Bottom: -4.01,126.55 131.78,126.55 131.78,-7.47 -4.04,-7.47 -4.04,126.45
INPUT_DIG_1
  Top 0.406: JP7.2 59.76,97.22 58.93,96.39 57.42,96.39 56.76,95.73 56.76,93.48 R15.2
INPUT_DIG_2
  Top 0.406: JP8.2 69.44,97.08 68.83,96.47 67.02,96.47 66.63,96.08 66.63,93.32 R18.2
INPUT_DIG_3
  Top 0.406: JP9.2 79.62,96.61 79.26,96.25 77.31,96.25 76.89,95.83 76.89,94.05 77.04,93.9 77.04,93.6 R21.2
INPUT_DIG_4
  Top 0.406: JP10.2 92.54,96.72 91.87,96.05 89.13,96.05 88.74,95.66 88.74,93.79 R24.2
INPUT_DIG_5
  Top 0.406: JP11.2 104.95,96.6 104.45,96.1 102.9,96.1 102.31,95.51 R27.2
INPUT_DIG_6
  Top 0.406: JP12.2 118.2,96.53 117.5,95.83 115.38,95.83 115.01,95.46 115.01,93.42 R30.2
IO0-DIN-4  (via drill 0.6)  (1 unrouted)
  Top 0.254: v68.99,32.26 68.9,32.17 66.6,32.17 65.39,33.38 55.73,33.38 54.79,34.32 30.91,34.32 30.26,34.97 30.26,43.97 30.86,44.57 34.35,44.57 35.69,46.1 35.69,57.84 32.89,60.64 27.84,60.64 27.11,59.91 22.51,59.91 21.82,60.6 21.82,69.37 23.17,70.72 24.45,70.72 TP8-DIN-4.1
  Top 0.406: OK4.4 93.86,79.66 R26.2 93.76,79.91 93.5,79.65 OK4.4 91.33,79.62 91.33,69.48 73.78,51.93 73.78,44.68 73.49,44.39
  Bottom 0.254: v68.99,32.26 70.78,32.26 74.27,35.75 74.27,44.31 SV2.13
IO5-DOUT-1  (via drill 0.6)
  Top 0.254: TP11-DOUT-1.1 35.67,42.41 36.3,43.1 36.3,54.63 37.54,55.81 48.04,55.81 50.14,53.71 55.53,53.71 57,52.24 59.55,52.24 60.04,52.73 60.04,54.65 59.49,55.2 59.49,55.21 57.18,57.52 54.42,57.52 v53.75,58.19
  Top 0.406: R33.1 10.07,77.77 10.83,77.01 25.99,77.01 26.94,76.06 36.31,76.06 38.84,73.53 38.84,64.17 40.96,62.05 49.89,62.05 v53.75,58.19 | v66.09,58.03 SV2.10
  Bottom 0.406: v53.75,58.19 65.93,58.19 v66.09,58.03
IO13-DI-RS485  (via drill 0.6)
  Top 0.254: JP6.4 121.53,57.37 120.95,57.95 99.79,57.95 98.99,58.75 v98.92,58.75
  Bottom 0.254: v98.92,58.75 90.07,58.75 81.2,67.62 81.2,74.73 80.32,75.61 74.31,75.61 73.48,74.78 73.48,73.13 SV1.3
IO14-RO-RS485  (via drill 0.6)
  Top 0.254: JP6.1 98.87,54.89 v97.66,56.1 | v78.46,68.68 68.3,68.68 66.1,70.52 SV1.6
  Bottom 0.254: v97.66,56.1 90.68,56.1 v78.46,68.68
IO15-DIN-3  (via drill 0.6)
  Top 0.406: OK3.4 81.85,79.68 R23.2 81.8,79.93 81.59,79.72 79.55,79.72 79.4,79.57 79.4,76.26 78.72,75.58 76.7,75.58 76.18,75.06 76.18,72.97 SV1.2 | TP7-DIN-3.1 32.96,68.41 33.34,68.03 33.34,61.29 37.21,57.42 43.4,57.42 v43.7,57.72
  Bottom 0.406: v43.7,57.72 47.83,57.72 54.26,64.15 73.32,64.15 76.49,67.32 76.49,72.66 SV1.2
IO18-DOUT-2  (via drill 0.6)
  Top 0.254: TP12-DOUT-2.1 41.39,40.34 42.95,38.78 51.94,38.78 53.89,40.73 53.89,41.35 55.4,42.86 56.86,42.86 57.16,43.16 57.16,47.26 v57.92,48.02 | v62.55,47.99 63.13,47.99 63.61,47.51
  Top 0.406: R35.1 27.25,77.72 27.69,77.28 36.63,77.28 39.61,74.3 39.61,64.86 41.23,63.24 51.1,63.24 v54.07,60.27 | v58.05,60.28 60.9,60.28 63.61,57.57 63.61,47.51 63.61,44.93 SV2.9
  Bottom 0.254: v57.92,48.02 62.52,48.02 v62.55,47.99
  Bottom 0.406: v54.07,60.27 v58.04,60.27 v58.05,60.28
IO19-DOUT-3
  Top 0.254: TP13-DOUT-3.1 52.62,38.23 54.58,40.19 54.58,41.02 55.67,42.11 57.77,42.11 58.5,42.84 60.92,42.84 61.11,43.03 61.11,44.77 SV2.8
  Top 0.406: R37.1 45.28,76.84 44.92,76.48 41.41,76.48 40.52,75.59 40.52,65.66 41.43,64.75 51.09,64.75 60.99,54.85 60.99,44.89 SV2.8
IO21-SDA  (via drill 0.6)
  Top 0.254: U$1.4 12.38,49.15 v13.51,50.28 16.69,50.28 17.17,50.76 v17.17,53.1 | v47.76,50.77 47.76,51.51 47.96,51.77 | v16.59,59.03 16.05,59.57 14.96,59.57 14.26,60.27 14.26,63.6 14.56,63.9 I2C.2 16.31,63.74 17.66,63.74 18.14,64.22 18.14,66.9 17.78,67.26 17.77,67.26 17.5,67.53 11.76,67.53 11.08,68.21 JP3.2
  Top 0.406: SV2.6 55.83,44.97 55.83,50.99 55.41,51.77 47.96,51.77 47.02,51.77 46.46,50.79 42.87,50.79 R13.2
  Bottom 0.254: v47.76,50.77 45.37,48.16 37.92,48.16 35.8,50.28 35.8,50.82 35.25,50.96 21.42,50.96 19.55,49.96 13.83,49.96 v13.51,50.28 | v16.59,59.03 16.59,53.68 v17.17,53.1
IO22-SCL  (via drill 0.6)
  Top 0.254: U$1.3 9.84,49.91 11.9,51.97 15.6,51.97 v15.76,52.13 | v37.18,50.9 39.01,50.9 R14.2 | I2C.3 14.28,66.44 13.63,65.79 13.63,64.96 | 13.63,64.96 13.63,58.99 v13.59,58.95 | JP4.2 13.27,64.6 13.63,64.96
  Top 0.406: R14.2 39.04,49.47 39.67,48.66 52.4,48.66 53.43,47.81 53.43,44.91 SV2.5
  Bottom 0.254: v13.59,58.95 v13.58,58.94 13.58,56.4 15.27,54.71 15.27,52.62 v15.76,52.13 15.85,52.22 22.08,52.22 22.54,51.53 29.43,51.53 30.35,51.95 36.28,51.95 37.18,51.05 v37.18,50.9
IO23-RE/DE-RS485  (via drill 0.6)
  Top 0.254: JP6.3 JP6.2 116.45,53.12 v113.28,49.95 | v59.32,50.61 59.32,45.72 SV2.7
  Bottom 0.254: v113.28,49.95 93.95,49.95 88.13,55.77 58.21,55.77 56.4,53.96 56.4,51.65 56.93,51.12 58.81,51.12 v59.32,50.61
IO32-DIN-1  (via drill 0.6)
  Top 0.406: R17.2 61.63,79.53 OK1.4 59.38,75.5 59.12,75.24 48.92,75.24 48.46,74.78 48.46,73.03 SV1.13 | TP5-DIN-1.1 31.49,63.55 v31.7,63.76
  Bottom 0.406: v31.7,63.76 51.02,63.76 52.22,65.22 52.22,74.54 51.78,75.24 49.17,75.24 48.46,74.53 48.46,73.03 SV1.13 48.51,72.7
IO33-DIN-2  (via drill 0.6)
  Top 0.406: OK2.4 71.69,79.61 R20.2 71.44,79.87 71.21,79.64 69.17,79.64 69.17,75.02 68.9,74.75 59.61,74.75 59.54,74.68 51.24,74.68 50.94,74.38 50.94,72.97 SV1.12 | TP6-DIN-2.1 31.87,65.99 v31.9,66.15
  Bottom 0.406: v31.9,66.15 50.45,66.13 51.01,66.69 51.01,72.74 SV1.12
IO34-DIN-5  (via drill 0.6)
  Top 0.254: TP9-DIN-5.1 30.38,72.74 v32.15,70.97 | v49.1,70.24 53.04,70.24 53.58,70.78 53.58,72.71 SV1.11 | OK5.4 104.74,75.88 103.86,75 95.03,75 93.05,73.02 93.05,68.39 v91.01,66.35 | v84.45,67.78 81.86,67.78 80.65,66.57 80.65,63.65 v78.89,61.89 | v61.24,62.56 60.76,62.56 v57.67,65.65
  Top 0.406: R29.2 107.27,79.84 107,79.57 104.97,79.57 OK5.4
  Bottom 0.254: v32.15,70.97 39.61,70.97 41.83,68.75 47.61,68.75 v49.1,70.24 | v91.01,66.35 85.88,66.35 v84.45,67.78 | v78.89,61.89 61.91,61.89 v61.24,62.56 | v57.67,65.65 57.59,65.65 53.54,69.7 53.54,72.75 SV1.11
IO39-S_VN/39-DIN-6  (via drill 0.6)
  Top 0.254: TP10-DIN-6.1 22.77,74.76 19.63,71.62 19.63,59.75 21.58,57.8 23.72,57.8 v24.56,56.96 | v24.58,53.61 24.6,52.18 24.97,51.85 24.97,46.95 v29.19,43.73 | v37.61,45.42 37.61,46.09 38.75,47.23 48.44,47.23 v48.95,47.74
  Top 0.406: 119.61,79.47 OK6.4 117.52,79.47 117.51,79.48 117.51,76.25 v116.87,75.61 | 119.61,79.47 119.88,79.47 R32.2 120.04,79.9 119.61,79.47 | v111.68,72.21 111.68,70.69 110.94,69.95 110.94,66.53 110.55,66.14 94.51,66.14 90.12,61.75 90.12,52.42 86.4,48.7 76.27,48.67 v76.32,48.71 | v72.23,48.71 72.23,48.66 71.2,47.63 71.2,44.9 SV2.12
  Bottom 0.254: v24.56,56.96 24.58,56.79 v24.58,53.61 | v29.19,43.73 35.92,43.73 v37.61,45.42 | v48.95,47.74 48.95,47.85 49.6,48.5 53.97,48.5 55.46,47.01 69.03,47.01 SV2.12
  Bottom 0.406: v116.87,75.61 116.32,75.61 115.52,74.81 115.52,73.34 114.57,72.39 111.86,72.39 v111.68,72.21 | v76.32,48.71 v72.23,48.71
K1_C1
  Top 0.813: K1.3 10.79,109.36 10.79,112.38 11.79,113.38 11.79,114.91 11.71,115 X14.3.2
K1_C2
  Top 0.813: K1.2 16.37,96.78 16.37,99.31 18.41,101.35 18.41,104.76 14.58,108.59 14.58,112.34 15.54,113.3 15.54,114.94 15.5,114.98 X14.4.2
K2_C1
  Top 0.813: K2.3 26.18,111.8 26.18,113.07 26.68,113.57 26.68,114.29 27.02,114.63 27.02,114.87 26.93,114.97 X14.7.2
K2_C2
  Top 0.813: K2.2 34.23,96.91 34.23,100.02 35.83,101.62 35.83,105.42 29.47,111.78 29.47,113.41 30.81,114.75 30.81,114.83 30.76,114.88 X14.8.2
K3_C1
  Top 0.813: K3.3 42.73,113.64 42.73,114.44 X14.11.1 42.19,117.05 42.24,117.11 42.24,117.12 42.3,117.18
K3_C2
  Top 0.813: K3.2 53.01,96.76 53.01,100.61 55.32,102.92 55.32,104.84 46.52,113.57 46.52,114.45 X14.12.1
  Top 1.016: X14.12.1 46,117.02 46.03,117.05
N$1
  Top 0.254: R39.2 45.4,16.63 45.4,10.28 44.67,9.55 42.8,9.55 42.02,8.77 42.02,7.45 LED1.A
N$2
  Top 0.254: R4.2 12.6,23.39 | 12.6,23.39 11.32,23.39 R5.2 11.27,23.26 CR2.2 | R6.2 12.87,28.49 12.49,28.11 12.49,23.5 12.6,23.39
N$3
  Top 0.254: R1.2 4.31,23.08 | 4.31,23.08 3.16,23.08 R2.2 2.96,23.04 CR1.2 | R3.2 4.7,28.38 4.43,28.11 4.43,23.2 4.31,23.08
N$4
  Top 0.254: 20.91,23.26 R8.2 19.52,23.17 CR3.2 | 20.91,23.26 22.42,23.26 R7.2 | R9.2 21.21,28.57 20.89,28.25 20.89,23.28 20.91,23.26
N$5
  Top 0.254: 28.81,23.29 R11.2 27.6,23.2 CR4.2 | 28.81,23.29 30.26,23.29 R10.2 | R12.2 29.03,28.65 28.73,28.35 28.73,23.37 28.81,23.29
N$6  (via drill 0.6)
  Top 0.406: JP1.1 5.22,71.93 JP2.1 5.09,68.24 JP3.1 5.06,64.62 JP4.1 | JP4.1 5.04,63.26 | v8.03,43.83 7.35,43.15 3.26,43.15 2.43,43.98 2.43,46.56 1.92,47.07 1.92,59.4 4.35,61.83 4.35,63.91 JP4.1
  Bottom 0.406: v8.03,43.83 14.66,43.83 15.04,43.45 15.04,41.34 U$1.5
N$7
  Top 0.406: OK1.1 59.38,83.4 60.35,82.43 61.91,82.43 R16.1
N$8
  Top 0.406: R15.1 60.45,90.61 D2.2 62.36,85.72 R16.2
N$10
  Top 0.406: OK2.1 69.26,83.16 70.15,82.27 71.7,82.27 R19.1
N$11
  Top 0.406: R18.1 71.05,90.47 D3.2 72.62,86.03 R19.2
N$15
  Top 0.406: OK3.1 79.42,83.67 80.53,82.56 82.15,82.56 R22.1
N$16
  Top 0.406: R21.1 81.62,90.58 D4.2 83.13,86.34 R22.2
N$19
  Top 0.406: OK4.1 91.35,83.44 91.98,82.81 94,82.81 R25.1
N$20
  Top 0.406: R24.1 93.63,90.77 D5.2 95.4,89 95.4,86.91 94.24,85.75 R25.2
N$21
  Top 0.406: R33.2 R34.2 4.39,83.82 5.2,84.63 7.57,84.63 8.22,85.28 8.22,88.47 Q1.B
N$23
  Top 0.406: OK5.1 104.74,83.28 105.49,82.53 107.38,82.53 R28.1
N$24
  Top 0.406: R27.1 107.11,90.5 D6.2 108.69,88.91 108.69,87 107.45,85.76 R28.2
N$25
  Top 0.406: R35.2 21.73,81.75 R36.2 21.69,83.44 22.54,84.29 24.8,84.29 25.26,84.75 Q2.B
N$26
  Top 0.813: Q2.C SW9.COM
N$27
  Top 0.406: OK6.1 117.6,82.6 117.81,82.39 120.21,82.39 R31.1
N$28
  Top 0.406: R30.1 120.07,90.56 D7.2 121.44,86.46 R31.2
N$29
  Top 0.813: Q1.C 5.88,99.71 SW8.COM
N$30
  Top 0.813: D1.A 13.28,78.86 11.9,80.24 11.9,85.05 K1.4 11.24,85.71 11.24,91.46 7.56,95.14 7.56,99.97 SW8.A
N$31
  Top 0.813: 29.49,85.37 K2.4 | D8.A 30.41,78.82 29.38,79.85 29.38,85.26 K2.4 | SW9.A 24.94,96.27 29.48,91.73 29.48,85.36 K2.4
N$32
  Top 1.27: SW11.COM 95.72,6.08 D10.A
N$33
  Top 0.406: R37.2 39.8,81.59 R38.2 39.76,83.47 40.5,84.21 43.26,84.21 43.72,84.67 43.72,88.76 Q3.B
N$34
  Top 0.813: Q3.C 41.35,100.32 SW10.COM
N$35
  Top 0.813: 48.15,85.24 K3.4 | D9.A 49.16,78.65 48.18,79.63 48.18,85.13 K3.4 | SW10.A 43.19,96.13 48.22,91.1 K3.4
N$36  (1 unrouted)
  Top 0.254: R41.2 92.61,18.84 92.61,14.13 91.04,12.56 79.43,12.56 79.14,12.27 79.14,3.57 78.51,2.94 60.77,2.94 60.17,3.54 60.17,6.73 59.86,7.04 54.89,7.04
N$38
  Top 0.254: R40.2 61.44,16.91 61.44,14.94 60.21,13.71 58.12,13.71 57.36,12.95 53.97,12.95 53.24,12.22 53.24,10.91 49.7,7.37 48.23,7.37 LED2.A 48.2,7.02
OPEN_COLECTOR_1
  Top 0.813: SW8.B 3.62,100.06 3.62,102.12 4.17,102.67 5.96,102.67 7.73,104.44 7.73,116.93 7.9,116.77 X14.2.1
OPEN_COLECTOR_2
  Top 0.813: SW9.B 21,100.31 21,102.5 22.91,103.95 22.91,113.23 23.31,113.63 23.31,114.71 23.23,114.79 23.23,114.87 23.14,114.97 X14.6.2
OPEN_COLECTOR_3
  Top 0.813: SW10.B 39.36,100.48 39.36,103.39 37.98,104.77 37.92,112.87 37.91,113.12 37.91,114.51 X14.10.1 38.38,116.92 38.33,116.97 38.36,116.97
POWER_IN  (1 unrouted)
  Top 0.813: 81.97,6.24 81.97,7.26 81.94,7.29
  Top 1.016: 81.94,7.29 81.94,3.55 83.35,2.14
  Top 1.27: 83.35,2.14 88.04,2.14 88.85,2.38 88.85,6.95 89.91,8.01 91.27,8.01 SW11.A
SEÑAL_EXT_1  (via drill 0.6)
  Top 0.406: X1.1.1 51.23,117.59 51.25,117.62 51.25,115.66 51.32,115.59 51.32,113.09 55.24,109.17 59.98,109.17 62.46,106.69 62.46,104.99 v62.4,104.93
  Bottom 0.406: v62.4,104.93 62.4,100.04 JP7.1
SEÑAL_EXT_2  (via drill 0.6)
  Top 0.406: X3.1.1 64.25,117.47 64.5,117.72 64.5,115.73 64.39,115.62 64.39,113.15 72,105.54 v72,105.04
  Bottom 0.406: v72,105.04 72,100.03 JP8.1
SEÑAL_EXT_3  (via drill 0.6)
  Top 0.406: X4.1.1 77.2,117.61 77.33,117.74 77.33,115.77 77.24,115.68 77.24,111.38 82.25,106.37 82.25,105.07 v82.17,104.99
  Bottom 0.406: v82.17,104.99 JP9.1
SEÑAL_EXT_4  (via drill 0.6)
  Top 0.406: X5.1.1 90.2,117.58 90.24,117.62 90.24,115.72 90.31,115.65 90.31,112.17 95.03,107.45 95.03,105.41 v95,105.38
  Bottom 0.406: v95,105.38 95,99.81 JP10.1
SEÑAL_EXT_5  (via drill 0.6)
  Top 0.406: X6.1.1 103.17,117.55 103.19,117.58 103.19,115.32 103.3,115.21 103.3,111.76 107.48,107.58 107.48,105.37 v107.52,105.33
  Bottom 0.406: v107.52,105.33 107.52,99.92 JP11.1
SEÑAL_EXT_6  (1 unrouted)
  Top 0.406: JP12.1 120.74,109.35 116.03,114.06 116.01,114.13 116.01,117.8 116.03,117.73 116.03,115.73
SPDT1
  Top 0.254: OK1.2 56.26,87.15 55.16,88.25 55.16,92.04 | 55.16,92.04 55.16,100.57 56.3,101.71 56.3,106.43 48.9,113.83 48.9,119.31 49.48,119.89 54.58,119.89 55.56,118.91 55.56,117.55 55.05,117.04 55.05,114.98 55.06,114.98 X1.2.2 | D2.1 60.4,93.02 59.25,91.88 55.32,91.88 55.16,92.04
SPDT2  (via drill 0.6)
  Top 0.254: OK2.2 65.59,87.23 65.08,87.74 65.08,91.98 | 65.08,91.98 65.08,101.48 v65.44,101.84 | v65.54,105.38 65.54,108.22 61.77,111.99 61.77,119.52 62.56,120.31 67.51,120.31 68.02,119.8 68.02,116.97 X3.2.2 68.02,117.75 68.02,114.82 68.05,114.79 | D3.1 70.76,93.22 69.43,91.9 65.16,91.9 65.08,91.98
  Bottom 0.254: v65.44,101.84 65.44,105.28 v65.54,105.38
SPDT3  (via drill 0.6)
  Top 0.254: OK3.2 76.1,87.3 75.25,88.15 75.25,88.25 75.22,88.28 75.22,91.75 | 75.22,91.75 75.22,102.39 v75.26,102.43 | v75.35,105.11 75.35,115.46 75.05,115.76 75.05,119.07 76.01,120.03 80.74,120.03 81.25,119.52 81.25,117.89 X4.2.2 | X4.2.1 81.01,117.52 81.07,117.58 81.37,117.58 81.42,117.63 81.18,117.63 81.15,117.66 | D4.1 80.49,93.39 79.07,91.98 75.45,91.98 75.22,91.75
  Bottom 0.254: v75.26,102.43 75.26,105.02 v75.35,105.11
SPDT4  (via drill 0.6)
  Top 0.254: OK4.2 87.73,87.28 87.24,87.77 87.24,92.08 | 87.24,92.08 87.24,101.87 v87.48,102.11 | v87.45,105.17 87.45,119.02 88.38,119.95 93.74,119.95 93.98,119.71 93.98,117.11 X5.2.2 94.11,114.97 94.18,114.9 | D5.1 92.62,93.58 91.17,92.14 87.3,92.14 87.24,92.08
  Bottom 0.254: v87.48,102.11 87.48,105.14 v87.45,105.17
SPDT5  (via drill 0.6)  (1 unrouted)
  Top 0.254: OK5.2 101.06,86.96 100.55,87.47 100.55,91.89 | 100.55,91.89 v100.55,101.92 | v100.53,105.49 100.53,119.18 101.16,119.81 106.33,119.81 106.83,119.31 106.83,115.14 106.99,114.98 | D6.1 106.81,93.38 105.43,92 100.66,92 100.55,91.89
  Bottom 0.254: v100.55,101.92 100.55,105.47 v100.53,105.49
SPDT6
  Top 0.254: OK6.2 113.9,87.09 113.21,87.78 113.21,91.98 | 113.21,91.98 113.21,97.14 113.79,97.72 116.68,97.72 116.9,97.94 116.9,101.89 116.79,102 116.79,102.01 116.08,102.72 113.71,102.72 113.18,103.25 113.18,119.09 114.01,119.92 119.72,119.92 119.91,119.73 119.91,117.11 X7.2.2 119.84,115.33 119.97,115.2 | D7.1 118.43,93.52 116.74,91.83 113.36,91.83 113.21,91.98

## Text on the board
tNames: 12V | 12V | 12V | INPUT / ANODO | CATODO / SPDT | INPUT / ANODO | CATODO / SPDT | INPUT / ANODO | CATODO / SPDT | INPUT / ANODO | CATODO / SPDT | INPUT / ANODO | CATODO / SPDT | INPUT / ANODO | CATODO / SPDT | OPEN / COLECTOR | CONTAC. / 1 | CONTAC. / 2 | OUT DIGITAL 1 | OPEN / COLECTOR | CONTAC. / 1 | CONTAC. / 2 | OUT DIGITAL 2 | OPEN / COLECTOR | CONTAC. / 1 | CONTAC. / 2 | OUT DIGITAL 3 | PIN1 | PIN2 | PIN3 | PIN1 | PIN2 | PIN3 | PIN1 | PIN2 | PIN3 | PIN1 | PIN2 | PIN3 | PIN1 | PIN2 | PIN3 | PIN1 | PIN2 | PIN3 | INPUT DIGITAL 1 | INPUT DIGITAL 2 | INPUT DIGITAL 3 | INPUT DIGITAL 4 | INPUT DIGITAL 5 | INPUT DIGITAL 6 | OPEN COL. | RELE | Jumper | Jumper | Jumper | Jumper | Jumper | Jumper | OPEN COL. | RELE | OPEN COL. | RELE | SEÑAL / EXT. | SEÑAL / EXT. | SEÑAL / EXT. | SEÑAL / EXT. | SEÑAL / EXT. | SEÑAL / EXT. | SWTICH / SELECCION / RELE o / OPEN COLECTOR | SWTICH / SELECCION / RELE o / OPEN COLECTOR | SWTICH / SELECCION / RELE o / OPEN COLECTOR | VOLTS / INTERN. | VOLTS / INTERN. | VOLTS / INTERN. | VOLTS / INTERN. | VOLTS / INTERN. | VOLTS / INTERN. | E | C | B | E | C | B | E | C | B | M7 | M7 | M7 | 12V | 5V | GND | SCL | SWTICH SELECCION / VOLTS_SENSOR | SDA | TestPoint-DINPUT | PARA / INPUT | SELECCION / Address | 3V3 | C:/Users/Claudio/Pictures/LOGO PURCELL CERLIANI fondo blanco letra negra.bmp | TestPoint-ADC | USB | IN | IN | + | + | - | - | TestPoint-DOUT | STEPDOWN / 5V | STEPDOWN / 12V | RS485 SHIELD | CONSTELACION | CONSTELACION | TestPoint-PWR | + | - | - | + | OUT | OUT | Purcell Cerliani / Electronica y / Tecnologias SpA / 27022023 | SWITCH / ON/OFF / PRINCIPAL | GW / V1.0 | INPUT | TestPoint-PWR / PRINCIPAL | OUT | OUT | ADC1 | ADC3 | ADC2 | ADC4 | 12V | 24V | C:/Users/Claudio/Pictures/LOGO PURCELL CERLIANI fondo blanco letra negra.bmp | 5V | B | A | M7 | 5V | 12V | 24V